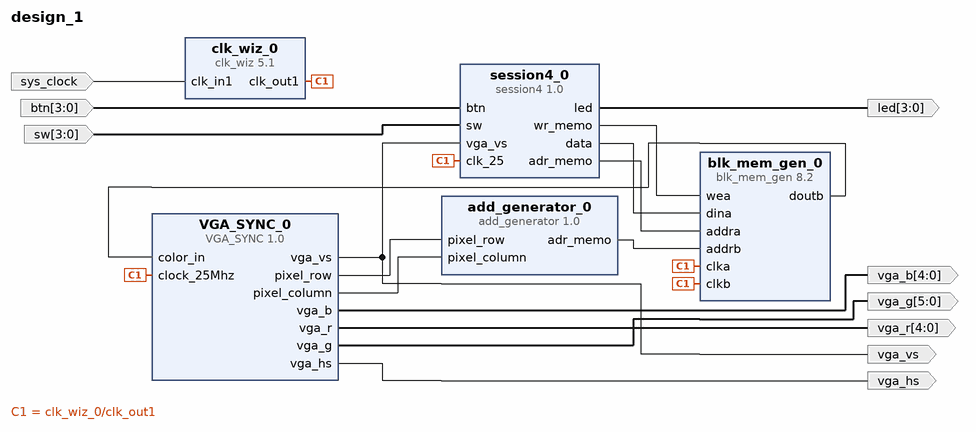
[diagram p0: block diagram of the top level]
# Vivado block design design_1, Vivado 2014.3.1
create_bd_design design_1

create_bd_port -dir I -type clk sys_clock
set_property -dict {CONFIG.FREQ_HZ 125000000 CONFIG.PHASE 0.000} [get_bd_ports sys_clock]
create_bd_port -dir I -from 3 -to 0 btn
create_bd_port -dir I -from 3 -to 0 sw
create_bd_port -dir O -from 4 -to 0 vga_r
create_bd_port -dir O -from 4 -to 0 vga_b
create_bd_port -dir O -from 5 -to 0 vga_g
create_bd_port -dir O vga_hs
create_bd_port -dir O vga_vs
create_bd_port -dir O -from 3 -to 0 led

create_bd_cell -type ip -vlnv xilinx.com:ip:session4:1.0 session4_0
create_bd_cell -type ip -vlnv xilinx.com:ip:add_generator:1.0 add_generator_0
create_bd_cell -type ip -vlnv xilinx.com:ip:blk_mem_gen:8.2 blk_mem_gen_0
set_property -dict [list \
  CONFIG.Memory_Type Simple_Dual_Port_RAM \
  CONFIG.Enable_32bit_Address false \
  CONFIG.Use_Byte_Write_Enable false \
  CONFIG.Write_Width_A 3 \
  CONFIG.Write_Depth_A 131072 \
  CONFIG.Operating_Mode_A NO_CHANGE \
  CONFIG.Enable_A Always_Enabled \
  CONFIG.Write_Width_B 3 \
  CONFIG.Read_Width_B 3 \
  CONFIG.Enable_B Always_Enabled \
  CONFIG.Register_PortB_Output_of_Memory_Primitives true \
  CONFIG.Fill_Remaining_Memory_Locations true \
  CONFIG.Remaining_Memory_Locations 7 \
  CONFIG.Port_B_Clock 100 \
  CONFIG.Port_B_Enable_Rate 100 \
  CONFIG.use_bram_block Stand_Alone \
] [get_bd_cells blk_mem_gen_0]
create_bd_cell -type ip -vlnv xilinx.com:ip:VGA_SYNC:1.0 VGA_SYNC_0
create_bd_cell -type ip -vlnv xilinx.com:ip:clk_wiz:5.1 clk_wiz_0
set_property -dict {CONFIG.USE_BOARD_FLOW true CONFIG.CLK_IN1_BOARD_INTERFACE sys_clock} [get_bd_cells clk_wiz_0]

# ---- connections ----

connect_bd_net [get_bd_pins clk_wiz_0/clk_out1] \
  [get_bd_pins blk_mem_gen_0/clka] [get_bd_pins blk_mem_gen_0/clkb] [get_bd_pins VGA_SYNC_0/clock_25Mhz] \
  [get_bd_pins session4_0/clk_25]
connect_bd_net [get_bd_ports sys_clock] [get_bd_pins clk_wiz_0/clk_in1]
connect_bd_net [get_bd_ports btn] [get_bd_pins session4_0/btn]
connect_bd_net [get_bd_ports sw] [get_bd_pins session4_0/sw]
connect_bd_net [get_bd_pins VGA_SYNC_0/pixel_row] [get_bd_pins add_generator_0/pixel_row]
connect_bd_net [get_bd_pins VGA_SYNC_0/pixel_column] [get_bd_pins add_generator_0/pixel_column]
connect_bd_net [get_bd_pins add_generator_0/adr_memo] [get_bd_pins blk_mem_gen_0/addrb]
connect_bd_net [get_bd_pins blk_mem_gen_0/doutb] [get_bd_pins VGA_SYNC_0/color_in]
connect_bd_net [get_bd_pins VGA_SYNC_0/vga_r] [get_bd_ports vga_r]
connect_bd_net [get_bd_pins VGA_SYNC_0/vga_b] [get_bd_ports vga_b]
connect_bd_net [get_bd_pins VGA_SYNC_0/vga_g] [get_bd_ports vga_g]
connect_bd_net [get_bd_pins VGA_SYNC_0/vga_hs] [get_bd_ports vga_hs]
connect_bd_net [get_bd_pins VGA_SYNC_0/vga_vs] [get_bd_ports vga_vs] [get_bd_pins session4_0/vga_vs]
connect_bd_net [get_bd_pins session4_0/wr_memo] [get_bd_pins blk_mem_gen_0/wea]
connect_bd_net [get_bd_pins session4_0/led] [get_bd_ports led]
connect_bd_net [get_bd_pins session4_0/data] [get_bd_pins blk_mem_gen_0/dina]
connect_bd_net [get_bd_pins session4_0/adr_memo] [get_bd_pins blk_mem_gen_0/addra]

validate_bd_design
save_bd_design
